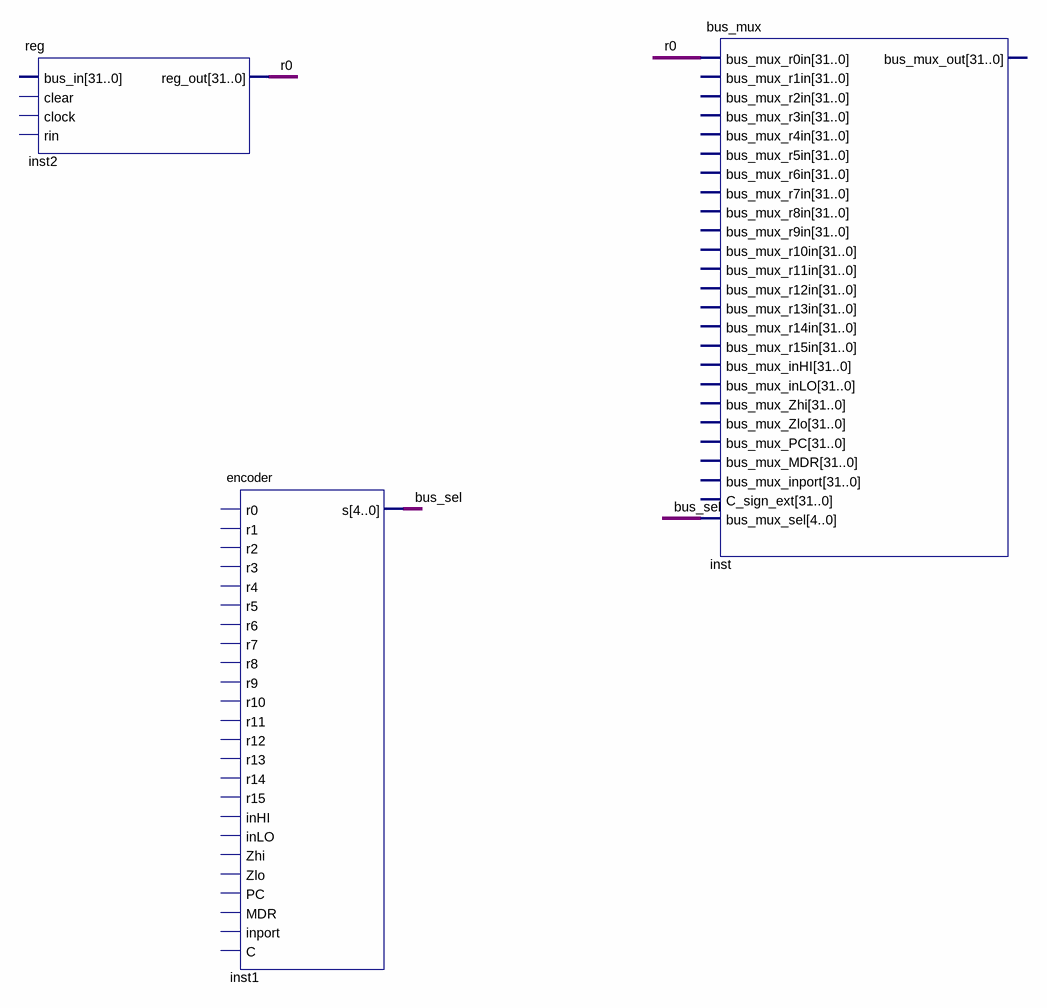
[diagram p0: schematic sheet]
// Quartus schematic blockDiagram.bdf as structural Verilog: 3 symbols, 0 pins
module blockDiagram (
);

  wire bus_sel, r0;

  \reg  inst2 (.reg_out(r0));  // open: bus_in, clear, clock, rin
  encoder inst1 (.s(bus_sel));  // open: r0, r1, r2, r3, r4, r5, r6, r7, r8, r9, r10, r11, r12, r13, r14, r15, inHI, inLO, Zhi, Zlo, PC, MDR, inport, C
  bus_mux inst (
    .bus_mux_r0in({32{r0}}), .bus_mux_sel({5{bus_sel}}));  // open: bus_mux_r1in, bus_mux_r2in, bus_mux_r3in, bus_mux_r4in, bus_mux_r5in, bus_mux_r6in, bus_mux_r7in, bus_mux_r8in, bus_mux_r9in, bus_mux_r10in, bus_mux_r11in, bus_mux_r12in, bus_mux_r13in, bus_mux_r14in, bus_mux_r15in, bus_mux_inHI, bus_mux_inLO, bus_mux_Zhi, bus_mux_Zlo, bus_mux_PC, bus_mux_MDR, bus_mux_inport, C_sign_ext, bus_mux_out
endmodule
